# Altium project Arduino_nano_atmega328p.PrjPcb
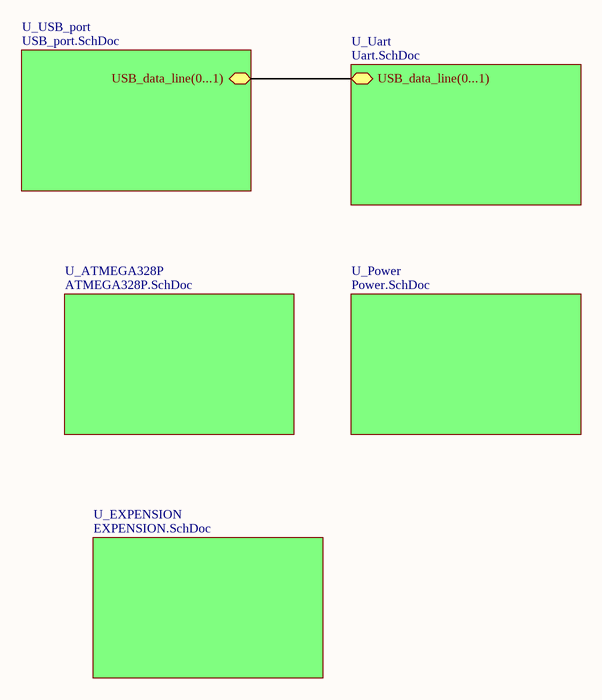
[diagram p0: main.SchDoc]
6 sheets, 26 parts. Net scope: global (net labels, ports and power ports of the same name join across sheets).
Board file: main.PcbDoc
Sheets:
  main.SchDoc
    U_USB_port = USB_port.SchDoc
    U_Uart = Uart.SchDoc
    U_Power = Power.SchDoc
    U_ATMEGA328P = ATMEGA328P.SchDoc
    U_EXPENSION = EXPENSION.SchDoc

## Sheet main.SchDoc
size A; SheetNumber: 0; SheetTotal: 6

### Sub-sheets
U_ATMEGA328P = ATMEGA328P.SchDoc: no entries
U_EXPENSION = EXPENSION.SchDoc: no entries
U_Power = Power.SchDoc: no entries
U_Uart = Uart.SchDoc: USB_data_line(0...1) (bidir)
U_USB_port = USB_port.SchDoc: USB_data_line(0...1) (bidir)

## Sheet USB_port.SchDoc
size A; SheetNumber: 1; SheetTotal: 6
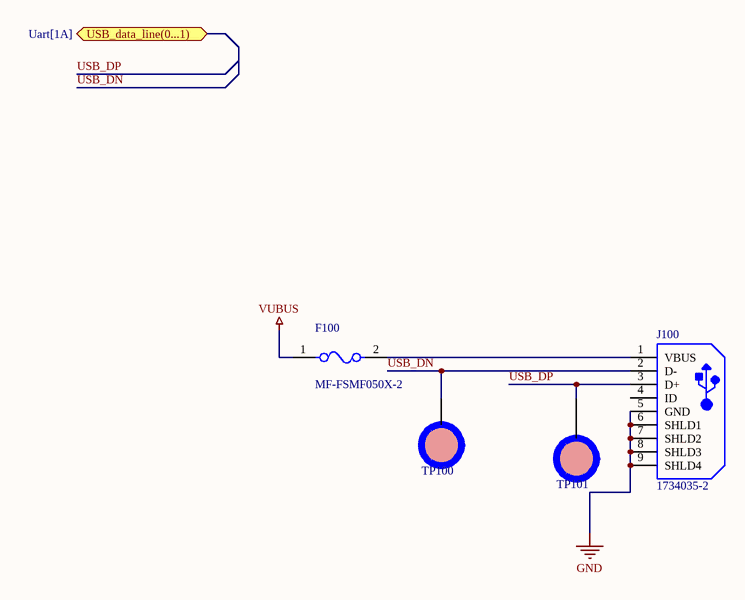
[diagram p1: USB_port.SchDoc]

### Parts
F100  MF-FSMF050X-2  [FP-MF-FSMF-MFG]
J100  1734035-2  [TECO-1734035-2-5_V]
TP100  TP  [TEST_POINT]  (value not drawn)  (no BOM)
TP101  TP  [TEST_POINT]  (value not drawn)  (no BOM)

### Ports
USB_data_line(0...1) (bidir, see Uart[1A])

### Nets
GND: J100.5(GND) J100.6(SHLD1) J100.7(SHLD2) J100.8(SHLD3) J100.9(SHLD4)
VUBUS: F100.1
USB_DN: J100.2(D-)
USB_DP: J100.3(D+)
NetF100_2: F100.2 J100.1(VBUS)

Not connected (* = marked no-connect by the designer): J100 4(ID); TP100 1; TP101 1

### Library data of the parts
F100 = CMP-07400-000010-1: PTC RESET FUSE 6V 500MA 0603; Manufacturer: Bourns Inc.; Trip Current: 1A; Current Rating: 40A; Hold Current: 0.5A; Resistance: 0.1-0.8Ω; Value: 0.1-0.8Ω; Description: Polymeric PTC Resettable Fuse 6V 500mA Ih Surface Mount 0603 (1608 Metric), Concave; Trip Time: 0.1s; Mouser Description: Resettable Fuses - PPTC 6volts 40amps; Category: Fuse; Digikey Description: PTC RESET FUSE 6V 500MA 0603; Temperature: -40°C to +85°C; Device Class L3: unset; Automotive: No; RoHS: TRUE; Ambient Temperature Range High: +85°C; Device Class L2: PTC Resettable Fuses; Temperature Range High: +85°C; Voltage Rating: 6V; Package: MF-FSMF; Manufacturer Part Number: MF-FSMF050X-2; Ambient Temperature Range Low: -40°C; Lead Free: Yes; ComponentLink2Description: Datasheet; Octopart: https://octopart.com/mf-fsmf050x-2-bourns-10470804; ComponentLink2URL: https://www.bourns.com/docs/Product-Datasheets/mffsmf.pdf; Temperature Range Low: -40°C; Height: 1mm; Device Class L1: Circuit Protection
J100 = CMP-2000-05407-1: Surface Mount Type B Mini USB, 5 Positions, 0.8 mm Pitch, 0 to 50 degC, RoHS, Tape and Reel; Manufacturer: TE Connectivity; Number of Contacts: 5; Pitch: 0.8mm; Body Orientation: RightAngle; Number of Ports: 1; Gender: RCP; Manufacturer URL: http://www.te.com/; Color: Black; Packaging: TapeandReel; Datasheet Version: Rev. B1, 07/2010; Housing Material: Thermoplastic; Termination Method: Solder; Part No: 1734035-2; Contact Plating: GoldOverNickel; Dimension: 4.14mm; Maximum Current Rating: N/A; Contact Material: PhosphorBronze; Number of Terminals: 5; Type: USB; Mounting: SurfaceMount; Datasheet URL: https://datasheet.ciiva.com/11759/0900766b80ed62f8-11759638.pdf; Operating Temperature: N/A; RoHS: Yes; Maximum Voltage Rating: N/A
TP100 TP101 = TEST_POINT

## Sheet Uart.SchDoc
size A; SheetNumber: 2; SheetTotal: 6
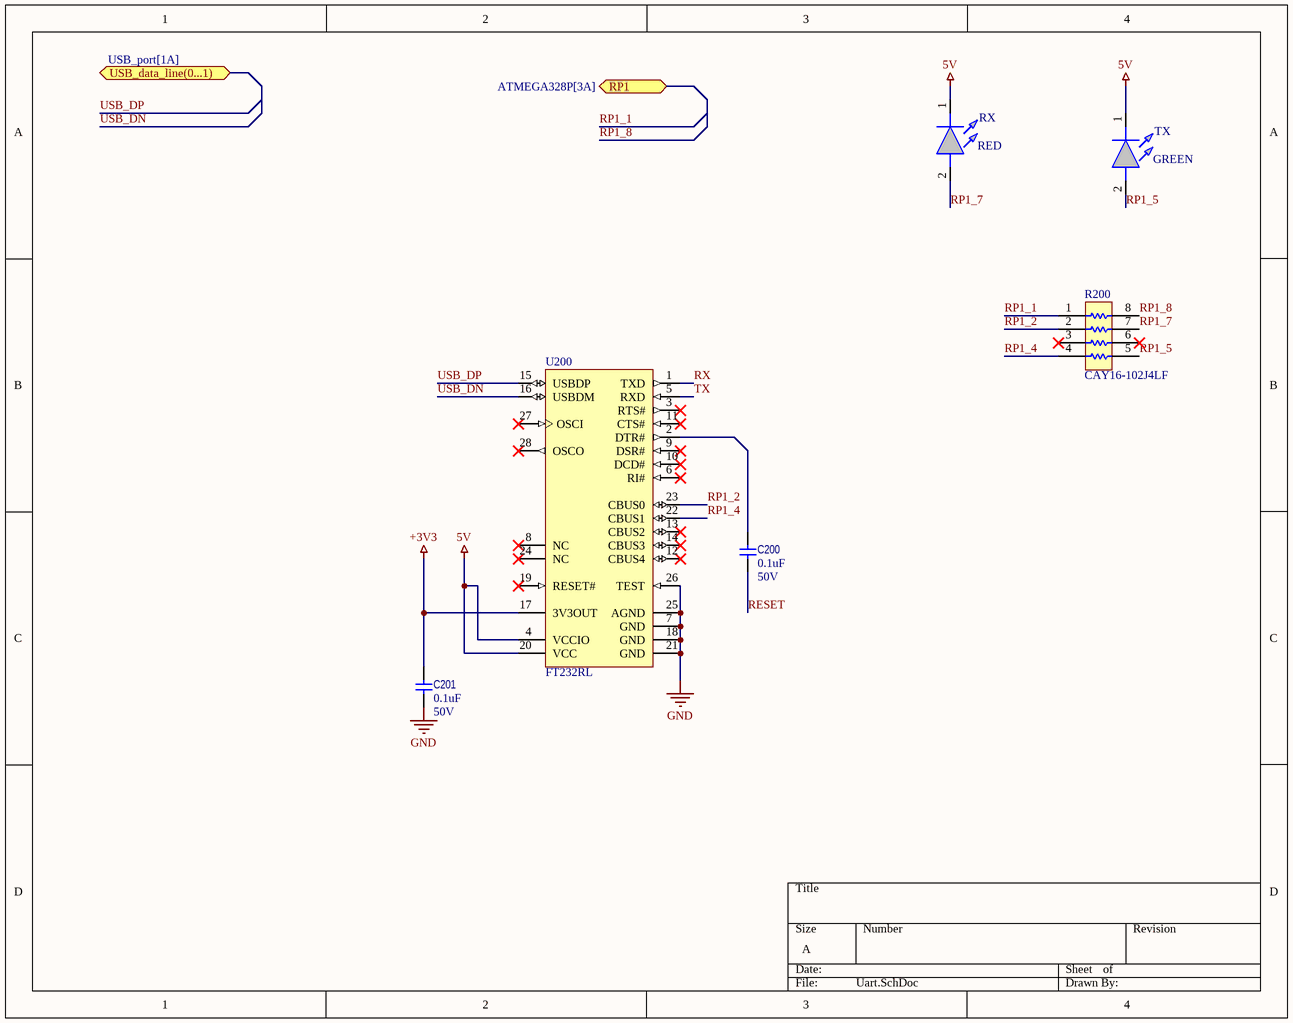
[diagram p2: Uart.SchDoc]

### Parts
C200  Voltage_Rating: 50V  [CAPC1005X55N]  (hidden comment: 0.1uF)
C201  Voltage_Rating: 50V  [CAPC1005X55N]  (hidden comment: 0.1uF)
R200  CAY16-102J4LF  [BOUR-CAY16-J4_V]
RX  COLOR: RED  [LEDC2012X75N]  (hidden comment: KPT-2012YC)
TX  COLOR: GREEN  [LEDC2012X75N]  (hidden comment: KPT-2012YC)
U200  FT232RL  [FTDI-SSOP-28_M]

### Ports
RP1 (bidir, see ATMEGA328P[3A]), USB_data_line(0...1) (bidir, see USB_port[1A])

### Nets
5V: RX.1(K) TX.1(K) U200.4(VCCIO) U200.20(VCC)  [project net RP2_3]
+3V3: C201.1 U200.17(3V3OUT)
GND: C201.2 U200.7(GND) U200.18(GND) U200.21(GND) U200.25(AGND) U200.26(TEST)
RESET: C200.2
RP1_1: R200.1  [project net PB5]
RP1_2: R200.2 U200.23(CBUS0)
RP1_4: R200.4 U200.22(CBUS1)
RP1_5: R200.5 TX.2(A)
RP1_7: R200.7 RX.2(A)
RP1_8: R200.8
RX: U200.1(TXD)  [project net RP2_8]
TX: U200.5(RXD)  [project net RP2_7]
USB_DN: U200.16(USBDM)
USB_DP: U200.15(USBDP)
NetC200_1: C200.1 U200.2(DTR#)

Not connected (* = marked no-connect by the designer): R200 3* 6*; U200 3(RTS#)* 6(RI#)* 8(NC)* 9(DSR#)* 10(DCD#)* 11(CTS#)* 12(CBUS4)* 13(CBUS2)* 14(CBUS3)* 19(RESET#)* 24(NC)* 27(OSCI)* 28(OSCO)*

### Library data of the parts
C200 C201 = 30041: CAP CER 0.1uF ±10% 50V X7R 0603 (1608 Metric); Part_Type: Capacitor; Manufacturer Part Number: C0603C104K5RECAUTO; Manufacturer: KEMET; Part_Status: New; ID: 30041; Updated By: randy; Sorted_Value: 1E-7; Value: 0.1uF; Sub_Type: CER; Manufacturer Part Description: CAP CER 0.1uF ±10% 50V X7R 0603 (1608 Metric); Supplier 1: DigiKey; Supplier Part Number 1: 399-14105-2-ND; Package_Case: 0603 (1608 Metric); RoHS: Yes; Temperature Range: -55C to +125C; Dielectric: X7R; Tolerance: ±10%; Created By: randy; Created_Date: 2024-03-31 22:55:42; Updated_Date: 2024-03-31 22:57:36; ComponentLink1Description: Datasheet; ComponentLink2Description: Supplier Part Details; ComponentLink2URL: https://www.digikey.com/products/en?keywords=C0603C104K5RECAUTO; Symbol Ref: CAP_NOPOL; Size / Dimension: 0.063in L x 0.031in W (1.60mm x 0.80mm)
R200 = CMP-1747-00007-1: Chip Resistor Array, 1 KOhm, +/- 5%, 62.5 mW, -55 to 125 degC, 8-Pin SMD, RoHS, Tape and Reel; Power Rating: 100 mW; Tolerance: 1%; Voltage Rating (DC): 50 V; Resistance: 330 Ohm; Case\Package: 0603; RoHSCompliant: true; Case Code (Metric): 1608; Pins: 2; PackageDescription: 8-Pin Surface Mount Device, Body 1.6 x 3.2 mm, Pitch 0.8 mm; Height: 0.45 mm; Min Operating Temperature: -55 degC; ComponentLink1URL: http://www.bourns.com/; Case Code (Imperial): 0603; Packaging: Tape and Reel; PackageReference: CAY16-J4; ComponentLink1Description: Manufacturer URL; ComponentLink2Description: Datasheet; Length: 1.6 mm; Width: 0.8 mm; Max Operating Temperature: 155 degC; Mount: Surface Mount; DatasheetVersion: Sep-14; Voltage Rating: 50 V; REACH SVHC: No SVHC; ComponentLink2URL: http://www.bourns.com/pdfs/CATCAY.pdf; Package Quantity: 5000
RX TX = KPT-2012YC: Kingbright KPT-2012YC Yellow LED, 588 nm, 2012 (0805), Rectangle Lens SMD Package; Geometry.Height: 0.75mm; Newark Part Number: *; Newark Price/Stock: *; Manufacturer_Name: Kingbright; Manufacturer_Part_Number: KPT-2012YC; Datasheet Link: https://componentsearchengine.com/Datasheets/2/KPT-2012YC.pdf
U200 = CMP-2000-05029-1: IC USB FS SERIAL UART 28-SSOP; Manufacturer: FTDI; Receive FIFO: 256B; Number of Channels per Chip: 1; Maximum Data Rate: 3MBd; Transmit FIFO: 128B; Dimensions: 10.2x5.3x1.75mm; Mounting Type: SurfaceMount; Height: 1.75mm; Package Type: SSOP; Datasheet Version: Rev. 1.04, 02/2006; Width: 5.3mm; Manufacturer URL: http://www.ftdichip.com/; Datasheet URL: http://datasheet.octopart.com/FT232RL-FTDI-datasheet-120501.pdf; Maximum Operating Temperature: +85degC; Minimum Operating Temperature: -40degC; Pin Count: 28; Length: 10.2mm

## Sheet Power.SchDoc
size A; SheetNumber: 3; SheetTotal: 6
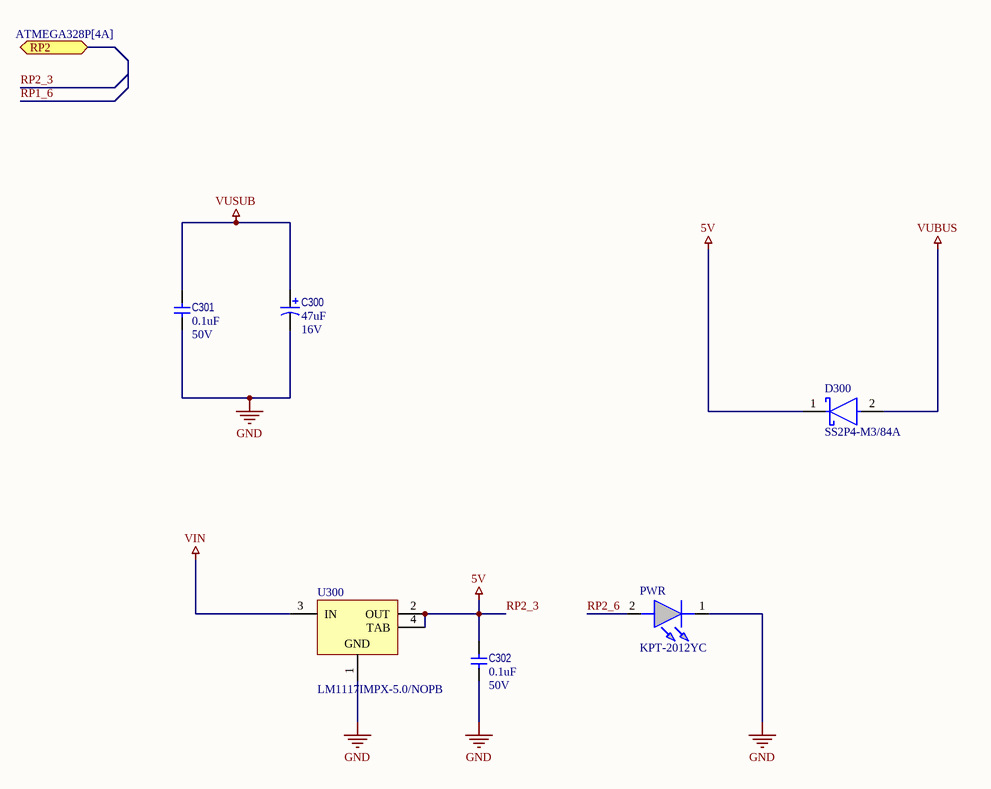
[diagram p3: Power.SchDoc]

### Parts
C300  Voltage_Rating: 16V  [CAPMP7343X430N]  (hidden comment: 47uF)
C301  Voltage_Rating: 50V  [CAPC1005X55N]  (hidden comment: 0.1uF)
C302  Voltage_Rating: 50V  [CAPC1005X55N]  (hidden comment: 0.1uF)
D300  SS2P4-M3/84A  [FP-96547-MFG]
PWR  KPT-2012YC  [LEDC2012X75N]
U300  LM1117IMPX-5.0/NOPB  [MP04A_M]

### Ports
RP2 (bidir, see ATMEGA328P[4A])

### Nets
GND: C300.2 C301.2 C302.2 PWR.1(K) U300.1(GND)
RP2_3: C302.1 D300.1(C) U300.2(OUT) U300.4(TAB)  [also labelled 5V]
VIN: U300.3(IN)
VUBUS: D300.2(A)
VUSUB: C300.1 C301.1
RP2_6: PWR.2(A)

### Library data of the parts
C300 = 30017: CAP TANT 47uF ±20% 16V 2917 (7343 Metric); Part_Type: Capacitor; Manufacturer Part Number: 16TQC47MW; Manufacturer: Panasonic; Part_Status: Obsolete; ID: 30017; Updated By: rclemmons; Sorted_Value: 4.7E-5; Value: 47uF; Sub_Type: TANT; Manufacturer Part Description: CAP TANT 47uF ±20% 16V 2917 (7343 Metric); Supplier 1: DigiKey; Supplier Part Number 1: P16487TR-ND; Package_Case: 2917 (7343 Metric); RoHS: Yes; Temperature Range: -55C to +105C; Tolerance: ±20%; Created By: rclemmons; Created_Date: 2014-12-11 21:29:30; Updated_Date: 2024-02-04 20:00:42; ComponentLink1Description: Datasheet; ComponentLink1URL: https://industrial.panasonic.com/cdbs/www-data/pdf/AAA8000/AAA8000C62.pdf; ComponentLink2Description: Supplier Part Details; ComponentLink2URL: https://www.digikey.com/products/en?keywords=16TQC47MW; Symbol Ref: CAP_POL; Size / Dimension: 0.287in L x 0.169in W (7.30mm x 4.30mm); Height - Seated (Max): 0.079in (2.00mm)
C301 C302 = 30041: as C200 on sheet Uart; Value: 0.1uF; Sub_Type: CER; Manufacturer Part Description: CAP CER 0.1uF ±10% 50V X7R 0603 (1608 Metric); Supplier 1: DigiKey; Supplier Part Number 1: 399-14105-2-ND; Package_Case: 0603 (1608 Metric); RoHS: Yes; Temperature Range: -55C to +125C; Dielectric: X7R; Tolerance: ±10%; Created By: randy; Created_Date: 2024-03-31 22:55:42; Updated_Date: 2024-03-31 22:57:36; ComponentLink1Description: Datasheet; ComponentLink2Description: Supplier Part Details; ComponentLink2URL: https://www.digikey.com/products/en?keywords=C0603C104K5RECAUTO; Symbol Ref: CAP_NOPOL; Size / Dimension: 0.063in L x 0.031in W (1.60mm x 0.80mm)
D300 = CMP-02539-000061-1: DIODE SCHOTTKY 40V 2A DO220AA; Peak Non-Repetitive Surge Current: 50A; Max Reverse Current: 150uA; Element Configuration: Single; Forward Voltage: 550mV; Package Quantity: 3000; Case/Package: DO-220AA; Packaging: Tape and Reel; Average Rectified Current: 2A; Number of Pins: 2; Mount: Surface Mount; Length: 3.61mm; Contact Plating: Tin; Max Operating Temperature: 150°C; Min Operating Temperature: -55°C; Series: eSMP®; RoHS Compliant: No; Max Reverse Voltage (DC): 40V; Width: 2.18mm; Max Surge Current: 50A; Max Forward Surge Current (Ifsm): 50A; Lead Free: Lead Free; Max Repetitive Reverse Voltage (Vrrm): 40V; Forward Current: 2A; Radiation Hardening: No; Height: 1.15mm
PWR = KPT-2012YC: as RX on sheet Uart; Newark Part Number: *; Newark Price/Stock: *; Manufacturer_Name: Kingbright; Manufacturer_Part_Number: KPT-2012YC; Datasheet Link: https://componentsearchengine.com/Datasheets/2/KPT-2012YC.pdf
U300 = CMP-0062-01628-3: 800mA Low-Dropout Linear Regulator, 4-pin SOT-223, Pb-Free; Manufacturer: National Semiconductor; CompType: LDO IC; High-Reliability: Y; PackageTopMarking: XYTT*N06B; PowerWise: N; ComponentLink3Description: LM1117 Web Page; ComponentLink3URL: http://www.national.com/pf/LM/LM1117.html; DatasheetVersion: Apr-2006; ComponentLink2Description: LM1117 Datasheet; PackageVersion: revB, Apr-2003; ComponentLink4Description: MP04A Package Page; ComponentLink1Description: Manufacturer URL; PartNumber: LM1117IMPX-5.0/NOPB; ComponentLink1URL: http://www.national.com/; PackageReference: MP04A; ComponentLink2URL: http://www.national.com/ds/LM/LM1117.pdf; PinCount: 4; Code_JEDEC: TO-261-AA; RevisionNote: SCH symbol layout adjusted; ComponentLink4URL: http://www.national.com/packaging/folders/mp04a.html; RoHS: Y; Code_IPC: SOT223-4; PackageDescription: Molded SOT-223, 6.50 x 3.56 x 1.6mm Body, 4 Lead, 2.3mm Pitch

## Sheet ATMEGA328P.SchDoc
size A; SheetNumber: 4; SheetTotal: 6
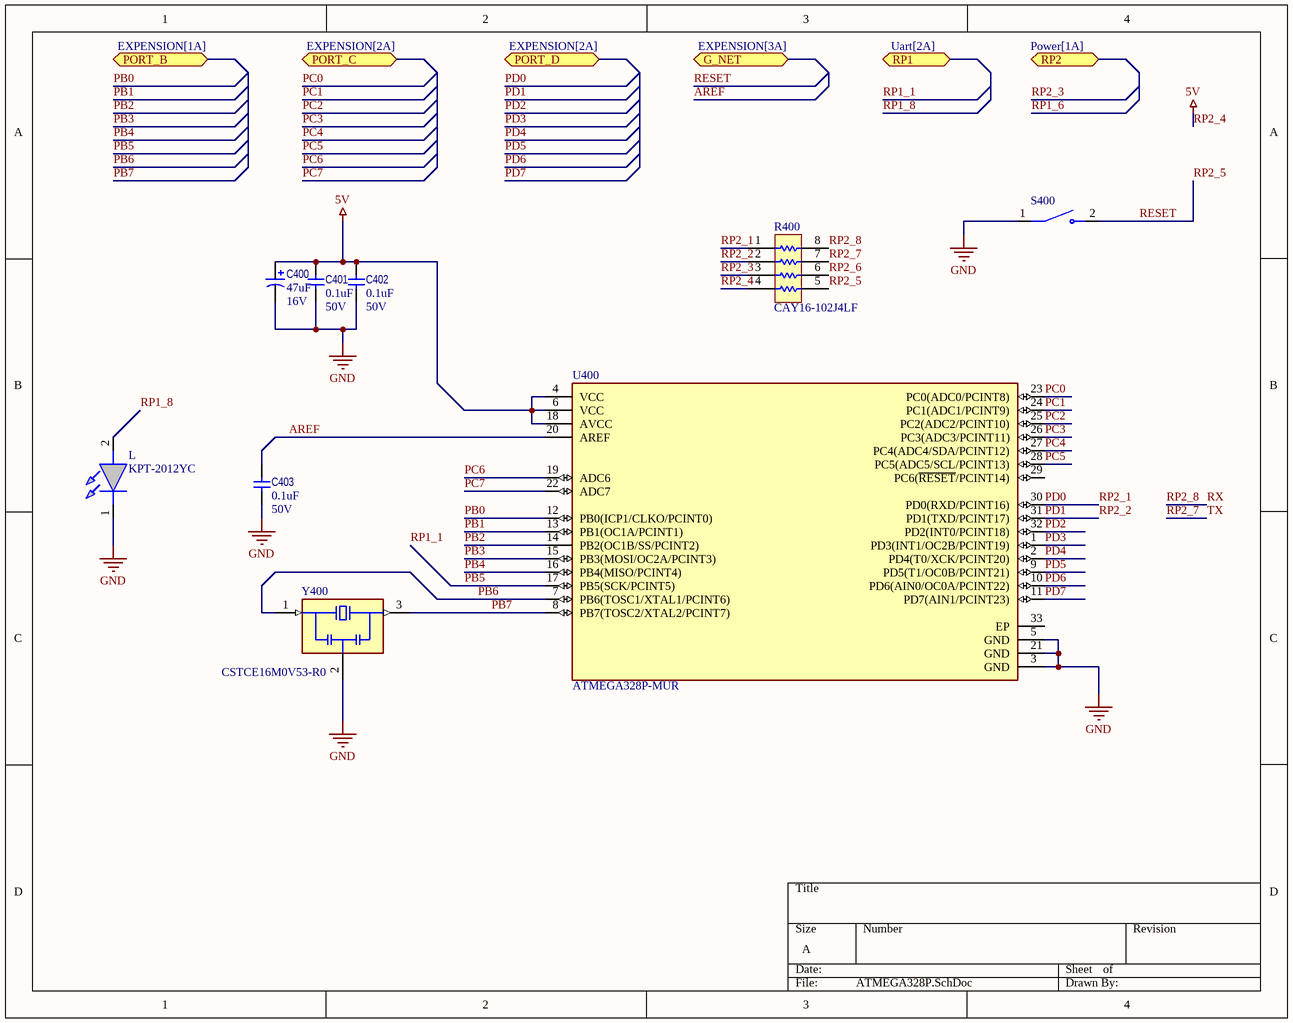
[diagram p4: ATMEGA328P.SchDoc]

### Parts
C400  Voltage_Rating: 16V  [CAPMP7343X430N]  (hidden comment: 47uF)
C401  Voltage_Rating: 50V  [CAPC1005X55N]  (hidden comment: 0.1uF)
C402  Voltage_Rating: 50V  [CAPC1005X55N]  (hidden comment: 0.1uF)
C403  Voltage_Rating: 50V  [CAPC1005X55N]  (hidden comment: 0.1uF)
L  KPT-2012YC  [LEDC2012X75N]
R400  CAY16-102J4LF  [BOUR-CAY16-J4_V]
S400  TS09-63-25-WT-160-SMT-TR  [SW_TS09-63-25-WT-160-SMT-TR]  (value not drawn)
U400  ATMEGA328P-MUR  [FP-32M1-A-IPC_C]
Y400  CSTCE16M0V53-R0  [OSC_CSTCE16M0V53-R0]

### Ports
G_NET (bidir, see EXPENSION[3A]), PORT_B (bidir, see EXPENSION[1A]), PORT_C (bidir, see EXPENSION[2A]), PORT_D (bidir, see EXPENSION[2A]), RP1 (bidir, see Uart[2A]), RP2 (bidir, see Power[1A])

### Nets
GND: C400.2 C401.2 C402.2 C403.2 L.1(K) S400.1 U400.3(GND) U400.5(GND) U400.21(GND) Y400.2(GND)
RP2_3: C400.1 C401.1 C402.1 R400.3 R400.4 U400.4(VCC) U400.6(VCC) U400.18(AVCC)  [also labelled 5V, RP2_4]
AREF: C403.1 U400.20(AREF)
PB0: U400.12(PB0(ICP1/CLKO/PCINT0))
PB1: U400.13(PB1(OC1A/PCINT1))
PB2: U400.14(PB2(OC1B/SS/PCINT2))
PB3: U400.15(PB3(MOSI/OC2A/PCINT3))
PB4: U400.16(PB4(MISO/PCINT4))
PB5: U400.17(PB5(SCK/PCINT5))  [also labelled RP1_1]
PB6: U400.7(PB6(TOSC1/XTAL1/PCINT6)) Y400.1(IN)
PB7: U400.8(PB7(TOSC2/XTAL2/PCINT7)) Y400.3(OUT)
PC0: U400.23(PC0(ADC0/PCINT8))
PC1: U400.24(PC1(ADC1/PCINT9))
PC2: U400.25(PC2(ADC2/PCINT10))
PC3: U400.26(PC3(ADC3/PCINT11))
PC4: U400.27(PC4(ADC4/SDA/PCINT12))
PC5: U400.28(PC5(ADC5/SCL/PCINT13))
PC6: U400.19(ADC6)
PC7: U400.22(ADC7)
PD0: R400.1 U400.30(PD0(RXD/PCINT16))  [also labelled RP2_1]
PD1: R400.2 U400.31(PD1(TXD/PCINT17))  [also labelled RP2_2]
PD2: U400.32(PD2(INT0/PCINT18))
PD3: U400.1(PD3(INT1/OC2B/PCINT19))
PD4: U400.2(PD4(T0/XCK/PCINT20))
PD5: U400.9(PD5(T1/OC0B/PCINT21))
PD6: U400.10(PD6(AIN0/OC0A/PCINT22))
PD7: U400.11(PD7(AIN1/PCINT23))
RESET: R400.5 S400.2  [also labelled RP2_5]
RP1_8: L.2(A)
RP2_6: R400.6
RP2_7: R400.7  [also labelled TX]
RP2_8: R400.8  [also labelled RX]

Not connected (* = marked no-connect by the designer): U400 29(PC6(~{RESET}/PCINT14)) 33(EP)

### Library data of the parts
C400 = 30017: as C300 on sheet Power; Value: 47uF; Sub_Type: TANT; Manufacturer Part Description: CAP TANT 47uF ±20% 16V 2917 (7343 Metric); Supplier 1: DigiKey; Supplier Part Number 1: P16487TR-ND; Package_Case: 2917 (7343 Metric); RoHS: Yes; Temperature Range: -55C to +105C; Tolerance: ±20%; Created By: rclemmons; Created_Date: 2014-12-11 21:29:30; Updated_Date: 2024-02-04 20:00:42; ComponentLink1Description: Datasheet; ComponentLink1URL: https://industrial.panasonic.com/cdbs/www-data/pdf/AAA8000/AAA8000C62.pdf; ComponentLink2Description: Supplier Part Details; ComponentLink2URL: https://www.digikey.com/products/en?keywords=16TQC47MW; Symbol Ref: CAP_POL; Size / Dimension: 0.287in L x 0.169in W (7.30mm x 4.30mm); Height - Seated (Max): 0.079in (2.00mm)
C401-C403 = 30041: as C200 on sheet Uart; Value: 0.1uF; Sub_Type: CER; Manufacturer Part Description: CAP CER 0.1uF ±10% 50V X7R 0603 (1608 Metric); Supplier 1: DigiKey; Supplier Part Number 1: 399-14105-2-ND; Package_Case: 0603 (1608 Metric); RoHS: Yes; Temperature Range: -55C to +125C; Dielectric: X7R; Tolerance: ±10%; Created By: randy; Created_Date: 2024-03-31 22:55:42; Updated_Date: 2024-03-31 22:57:36; ComponentLink1Description: Datasheet; ComponentLink2Description: Supplier Part Details; ComponentLink2URL: https://www.digikey.com/products/en?keywords=C0603C104K5RECAUTO; Symbol Ref: CAP_NOPOL; Size / Dimension: 0.063in L x 0.031in W (1.60mm x 0.80mm)
L = KPT-2012YC: as RX on sheet Uart; Newark Part Number: *; Newark Price/Stock: *; Manufacturer_Name: Kingbright; Manufacturer_Part_Number: KPT-2012YC; Datasheet Link: https://componentsearchengine.com/Datasheets/2/KPT-2012YC.pdf
R400 = CMP-1747-00007-1: as R200 on sheet Uart; RoHSCompliant: true; Case Code (Metric): 1608; Pins: 2; PackageDescription: 8-Pin Surface Mount Device, Body 1.6 x 3.2 mm, Pitch 0.8 mm; Height: 0.45 mm; Min Operating Temperature: -55 degC; ComponentLink1URL: http://www.bourns.com/; Case Code (Imperial): 0603; Packaging: Tape and Reel; PackageReference: CAY16-J4; ComponentLink1Description: Manufacturer URL; ComponentLink2Description: Datasheet; Length: 1.6 mm; Width: 0.8 mm; Max Operating Temperature: 155 degC; Mount: Surface Mount; DatasheetVersion: Sep-14; Voltage Rating: 50 V; REACH SVHC: No SVHC; ComponentLink2URL: http://www.bourns.com/pdfs/CATCAY.pdf; Package Quantity: 5000
U400 = CMP-06276-000062-1: IC MCU 8BIT 32KB FLASH 32VQFN; Number of I/Os: 24; Core Architecture: PIC; Frequency: 20MHz; Memory Size: 3.5KB; Interface: I2C; Peripherals: Brown-out Detect/Reset; Oscillator Type: Internal; Case/Package: VQFN; Min Operating Temperature: -40°C; Packaging: Rail/Tube; Max Operating Temperature: 125°C; Memory Type: FLASH
Y400 = CSTCE16M0V53-R0: 16 MHz Ceramic Resonator Built in Capacitor 15 pF Â±0.3% -20Â°C ~ 80Â°C Surface Mount; MF: Murata; Price: None; Package: SMD-3 Murata; Purchase-URL: https://pricing.snapeda.com/search/part/CSTCE16M0V53-R0/?ref=eda; Availability: In Stock; SnapEDA_Link: https://www.snapeda.com/parts/CSTCE16M0V53-R0/Murata+Electronics+North+America/view-part/?ref=snap; Value: *; MP: CSTCE16M0V53-R0; Check_prices: https://www.snapeda.com/parts/CSTCE16M0V53-R0/Murata+Electronics+North+America/view-part/?ref=eda
S400 = TS09-63-25-WT-160-SMT-TR: Price: None; Availability: Unavailable; Package: None; Value: *; MP: TS09-63-25-WT-160-SMT-TR

## Sheet EXPENSION.SchDoc
size A; SheetNumber: 5; SheetTotal: 6
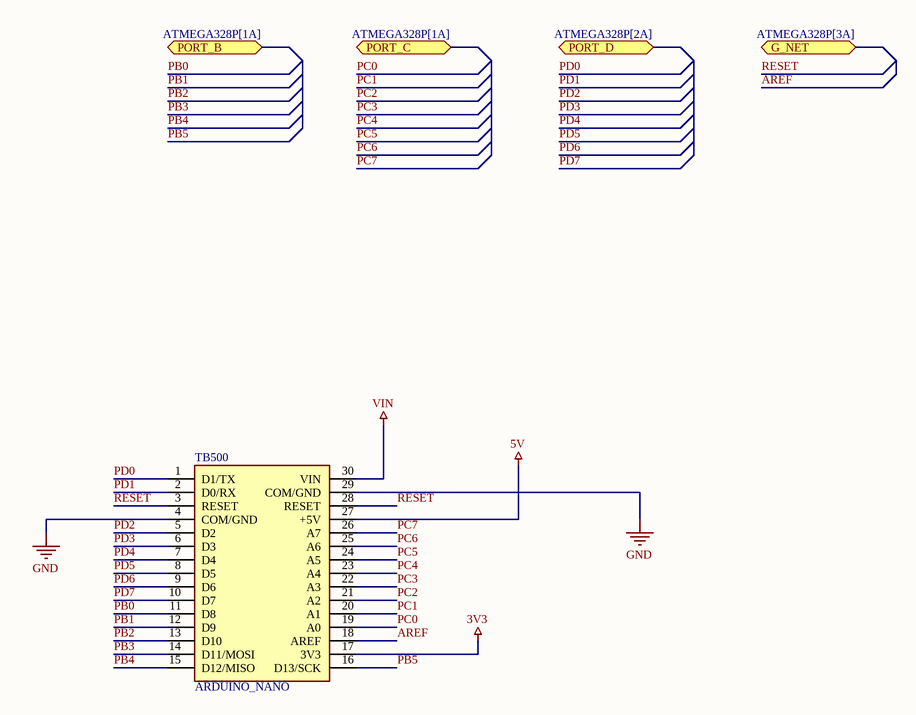
[diagram p5: EXPENSION.SchDoc]

### Parts
TB500  ARDUINO_NANO  [SHIELD_ARDUINO_NANO]

### Ports
G_NET (bidir, see ATMEGA328P[3A]), PORT_B (bidir, see ATMEGA328P[1A]), PORT_C (bidir, see ATMEGA328P[1A]), PORT_D (bidir, see ATMEGA328P[2A])

### Nets
3V3: TB500.17(3V3)
5V: TB500.27(+5V)  [project net RP2_3]
GND: TB500.4(COM/GND) TB500.29(COM/GND)
VIN: TB500.30(VIN)
AREF: TB500.18(AREF)
PB0: TB500.11(D8)
PB1: TB500.12(D9)
PB2: TB500.13(D10)
PB3: TB500.14(D11/MOSI)
PB4: TB500.15(D12/MISO)
PB5: TB500.16(D13/SCK)
PC0: TB500.19(A0)
PC1: TB500.20(A1)
PC2: TB500.21(A2)
PC3: TB500.22(A3)
PC4: TB500.23(A4)
PC5: TB500.24(A5)
PC6: TB500.25(A6)
PC7: TB500.26(A7)
PD0: TB500.1(D1/TX)
PD1: TB500.2(D0/RX)
PD2: TB500.5(D2)
PD3: TB500.6(D3)
PD4: TB500.7(D4)
PD5: TB500.8(D5)
PD6: TB500.9(D6)
PD7: TB500.10(D7)
RESET: TB500.3(RESET) TB500.28(RESET)

### Library data of the parts
TB500 = ARDUINO_NANO: Small, complete, and breadboard-friendly board based on the ATmega328 (Arduino Nano 3.x); MF: Arduino; SnapEDA_Link: https://www.snapeda.com/parts/Arduino%20Nano/Arduino/view-part/?ref=snap; Package: Non-Standard Arduino; Price: None; Availability: Not in stock; Value: *; Check_prices: https://www.snapeda.com/parts/Arduino%20Nano/Arduino/view-part/?ref=eda; MP: Arduino Nano

## Nets that join several sheets
GND: USB_port (5 pins), Uart (6 pins), Power (5 pins), ATMEGA328P (10 pins), EXPENSION (TB500.4 TB500.29)
RP2_3: Uart (RX.1 TX.1 U200.4 U200.20), Power (C302.1 D300.1 U300.2 U300.4), ATMEGA328P (8 pins), EXPENSION (TB500.27)
VIN: Power (U300.3), EXPENSION (TB500.30)
VUBUS: USB_port (F100.1), Power (D300.2)
AREF: ATMEGA328P (C403.1 U400.20), EXPENSION (TB500.18)
PB0: ATMEGA328P (U400.12), EXPENSION (TB500.11)
PB1: ATMEGA328P (U400.13), EXPENSION (TB500.12)
PB2: ATMEGA328P (U400.14), EXPENSION (TB500.13)
PB3: ATMEGA328P (U400.15), EXPENSION (TB500.14)
PB4: ATMEGA328P (U400.16), EXPENSION (TB500.15)
PB5: Uart (R200.1), ATMEGA328P (U400.17), EXPENSION (TB500.16)
PC0: ATMEGA328P (U400.23), EXPENSION (TB500.19)
PC1: ATMEGA328P (U400.24), EXPENSION (TB500.20)
PC2: ATMEGA328P (U400.25), EXPENSION (TB500.21)
PC3: ATMEGA328P (U400.26), EXPENSION (TB500.22)
PC4: ATMEGA328P (U400.27), EXPENSION (TB500.23)
PC5: ATMEGA328P (U400.28), EXPENSION (TB500.24)
PC6: ATMEGA328P (U400.19), EXPENSION (TB500.25)
PC7: ATMEGA328P (U400.22), EXPENSION (TB500.26)
PD0: ATMEGA328P (R400.1 U400.30), EXPENSION (TB500.1)
PD1: ATMEGA328P (R400.2 U400.31), EXPENSION (TB500.2)
PD2: ATMEGA328P (U400.32), EXPENSION (TB500.5)
PD3: ATMEGA328P (U400.1), EXPENSION (TB500.6)
PD4: ATMEGA328P (U400.2), EXPENSION (TB500.7)
PD5: ATMEGA328P (U400.9), EXPENSION (TB500.8)
PD6: ATMEGA328P (U400.10), EXPENSION (TB500.9)
PD7: ATMEGA328P (U400.11), EXPENSION (TB500.10)
RESET: Uart (C200.2), ATMEGA328P (R400.5 S400.2), EXPENSION (TB500.3 TB500.28)
RP1_8: Uart (R200.8), ATMEGA328P (L.2)
RP2_6: Power (PWR.2), ATMEGA328P (R400.6)
RP2_7: Uart (U200.5), ATMEGA328P (R400.7)
RP2_8: Uart (U200.1), ATMEGA328P (R400.8)
USB_DN: USB_port (J100.2), Uart (U200.16)
USB_DP: USB_port (J100.3), Uart (U200.15)